# Altium schematic sheet USB.SchDoc: SIM868 Development Board
size 149 x 149 mm; SheetNumber: 3; SheetTotal: 14
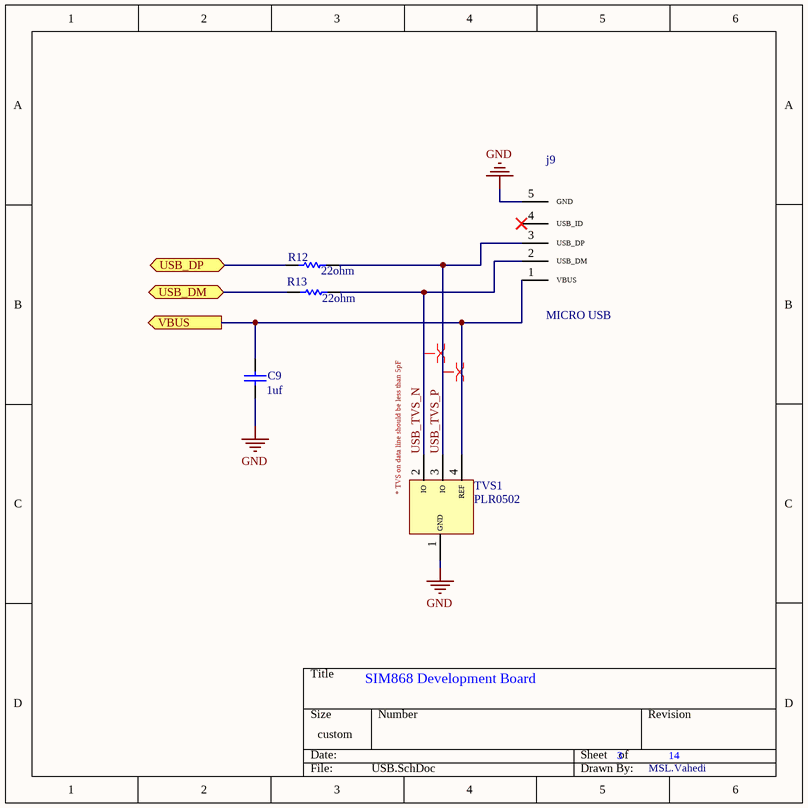
[diagram p0: USB.SchDoc]

## Parts
C9  value 1uf  [CAP0805]
j9  MICRO USB  [Micro_USB]
R12  value 22ohm  [RES0805]
R13  value 22ohm  [RES0805]
TVS1  PLR0502  [PLR0502]

## Ports
USB_DM (bidir), USB_DP (bidir), VBUS (out)

## Nets
GND: C9.1 j9.5(GND) TVS1.1(GND)
USB_DM: R13.1 ; port USB_DM
USB_DP: R12.1 ; port USB_DP
USB_TVS_N: j9.2(USB_DM) R13.2 TVS1.2(IO)
USB_TVS_P: j9.3(USB_DP) R12.2 TVS1.3(IO)
VBUS: C9.2 j9.1(VBUS) TVS1.4(REF) ; port VBUS

Not connected (* = marked no-connect by the designer): j9 4(USB_ID)*

## Layout directives
differential pair; differential pair class USBDIFF: USB_TVS_N, USB_TVS_P

## Notes on the sheet
- (near TVS1) * TVS on data line should be less than 5pF
- MSL.Vahedi

## Library data of the parts
C9 = Cap: Capacitor; Published: 8-Jun-2000; LatestRevisionDate: 17-Jul-2002; LatestRevisionNote: Re-released for DXP Platform.; PackageReference: RAD-0.3; Publisher: Altium Limited; PackageDescription: Radial Cap, Thru-Hole; 2 Leads; 0.3 in Pin Spacing
R12 R13 = Res1: Published: 8-Jun-2000; LatestRevisionDate: 17-Jul-2002; LatestRevisionNote: Re-released for DXP Platform.; PackageReference: AXIAL-0.3; Publisher: Altium Limited; PackageDescription: Axial Device, Thru-Hole; 2 Leads; 0.3 in Pin Spacing